# EAGLE design TSAL Proto18_rev3.1 (EAGLE 7.2.0)
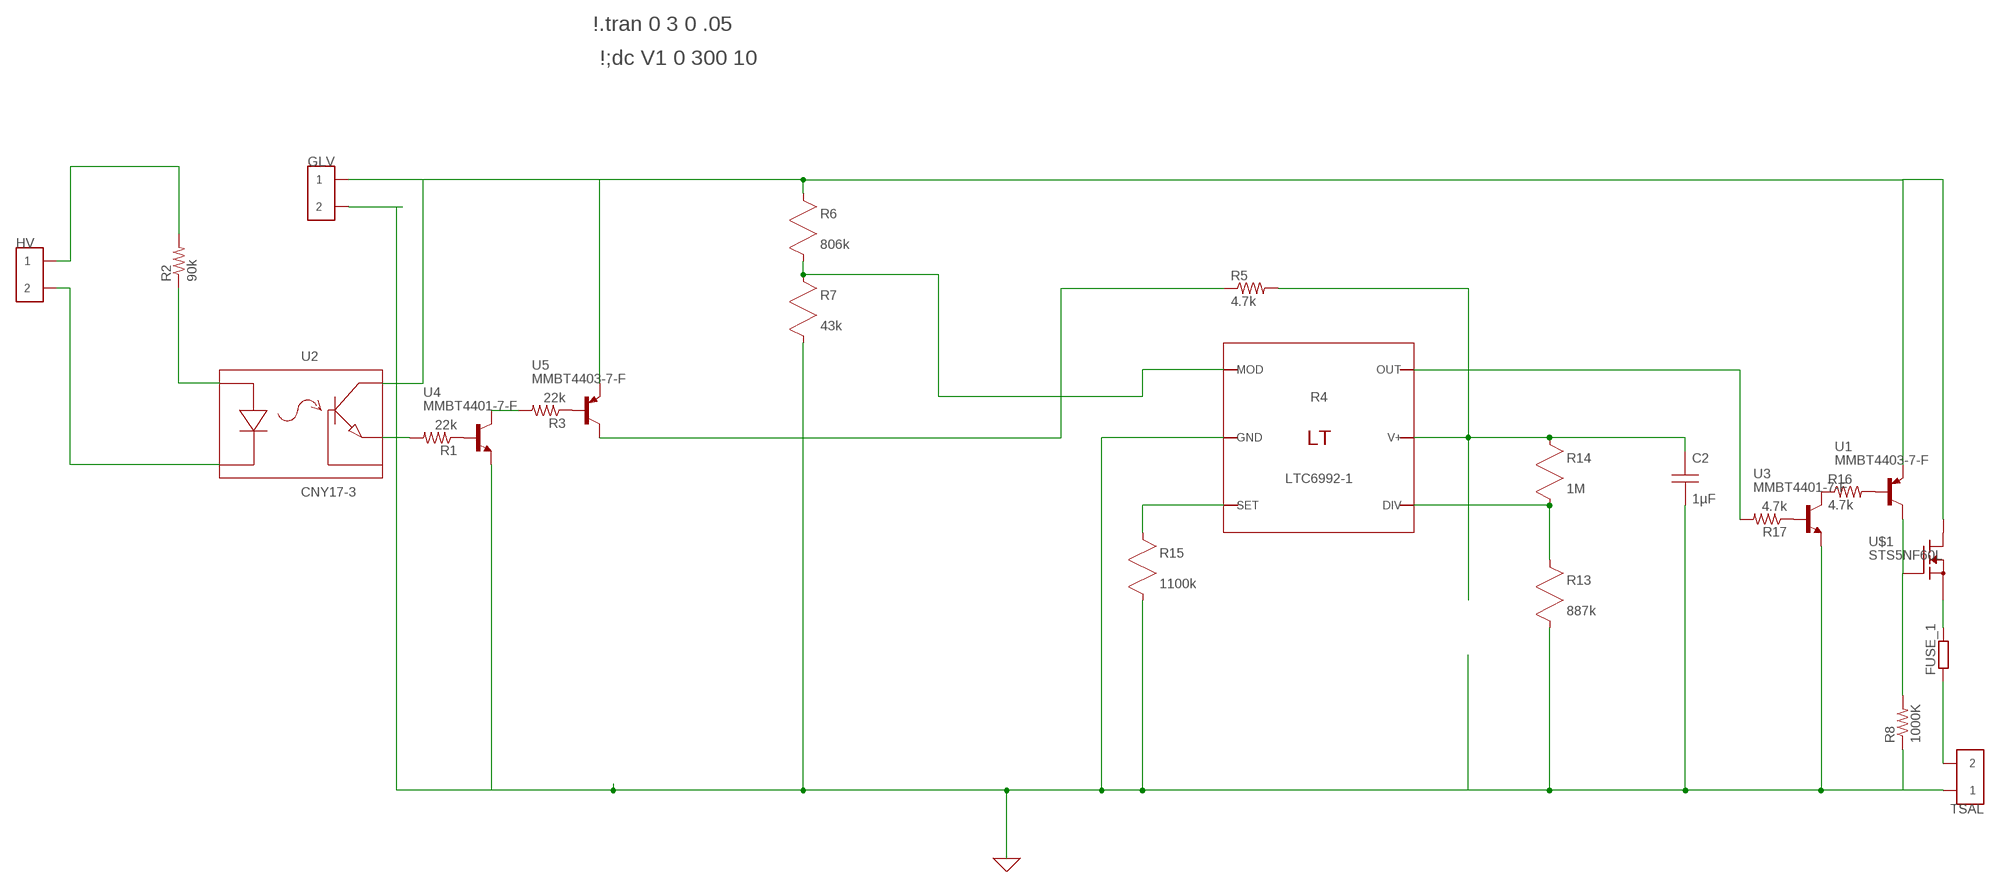
[diagram p0: schematic, sheet 1]

## Parts
C2  1µF  CAP  [C0805]
FUSE_1  R-EU_R0402  [R0402]
GLV  CONN_2  [CONNECTOR_2]
HV  CONN_2  [CONNECTOR_2]
R1  22k  R-US_R0402  [R0402]
R2  90k  R-US_0817/22  [P0817/22]
R3  22k  R-US_R0402  [R0402]
R4  LTC6992-1  [LTC6992-1]
R5  4.7k  RESISTOR0805-RES  [0805]
R6  806k  RES  [R0805]
R7  43k  RES  [R0805]
R8  1000K  RESISTOR0805-RES  [0805]
R13  887k  RES  [R0805]
R14  1M  RES  [R0805]
R15  1100k  RES  [R0805]
R16  4.7k  R-US_R0402  [R0402]
R17  4.7k  R-US_R0402  [R0402]
TSAL  CONN_2  [CONNECTOR_2]
U1  MMBT4403-7-F  [SOT-23-3]
U2  CNY17-3  [CNY17-3]
U3  MMBT4401-7-F  [SOT-23-3]
U4  MMBT4401-7-F  [SOT-23-3]
U5  MMBT4403-7-F  [SOT-23-3]
U$1  STS5NF60L  [SO08]

## Nets
12V: GLV.1 GLV.2 R6.1(A) U1.P$3(E) U2.P$5(C) U5.P$3(E) U$1.5(D) U$1.6(D) U$1.7(D) U$1.8(D)
GND: C2.2(B) GLV.3 GLV.4 R4.P$2(GND) R7.2(B) R8.1 R13.2(B) R15.2(B) TSAL.1 TSAL.2 U3.P$3(E) U4.P$3(E) ; supply symbol labelled 0
HV+: HV.1 HV.2 R2.2
HV-: HV.3 HV.4 U2.P$2(K)
N$1: R1.1 U4.P$2(B)
N$2: R3.1 U5.P$2(B)
N$3: R3.2 U4.P$1(C)
N$4: R1.2 U2.P$4(E)
N$5: R5.1 U5.P$1(C)
N$6: R8.2 U1.P$1(C) U$1.4(G)
N$7: R4.P$1(MOD) R6.2(B) R7.1(A)
N$8: R4.P$6(OUT) R17.2
N$9: R2.1 U2.P$1(A)
N$10: FUSE_1.2 U$1.1(S) U$1.2(S) U$1.3(S)
N$11: R16.2 U1.P$2(B)
N$13: R16.1 U3.P$1(C)
N$15: C2.1(A) R4.P$5(V+) R5.2 R14.1(A)
N$18: R4.P$3(SET) R15.1(A)
N$19: R4.P$4(DIV) R13.1(A) R14.2(B)
N$21: R17.1 U3.P$2(B)
TSAL+: FUSE_1.1 TSAL.3 TSAL.4
Unconnected: U2.P$6(B)

## Notes on the sheet
- \!.tran 0 3 0 .05
- \!;dc V1 0 300 10

## Library data of the parts
C2 = sym:CAP: Capacitor
FUSE_1 = resistor:R-EU_: RESISTOR, European symbol
GLV HV TSAL = formula electric:CONN_2
R1-R3 R16 R17 = resistor:R-US_: RESISTOR, American symbol
R4 = FE_Kenny:LTC6992-1
R5 R8 = SparkFun-Resistors:RESISTOR: Resistor Basic schematic elements and footprints for 0603, 1206, and PTH resistors.
R6 R7 R13-R15 = sym:RES: A resistor
U1 U5 = formula electric:MMBT4403-7-F
U2 = FE_Kenny:CNY17-3
U3 U4 = formula electric:MMBT4401-7-F
U$1 = st-microelectronics:STS5NF60L

## Board
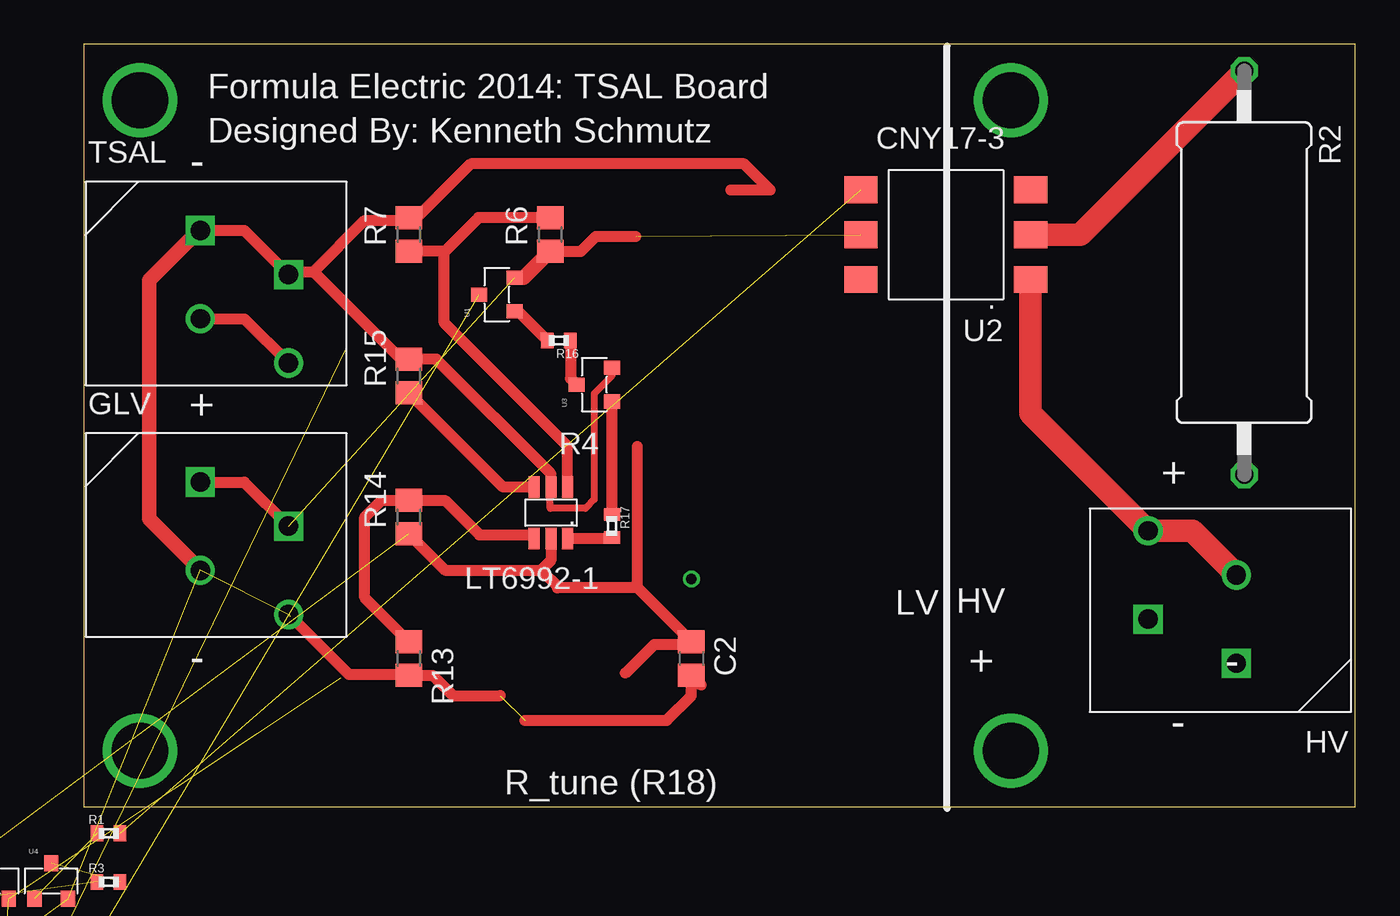
[diagram p1: board, top side]
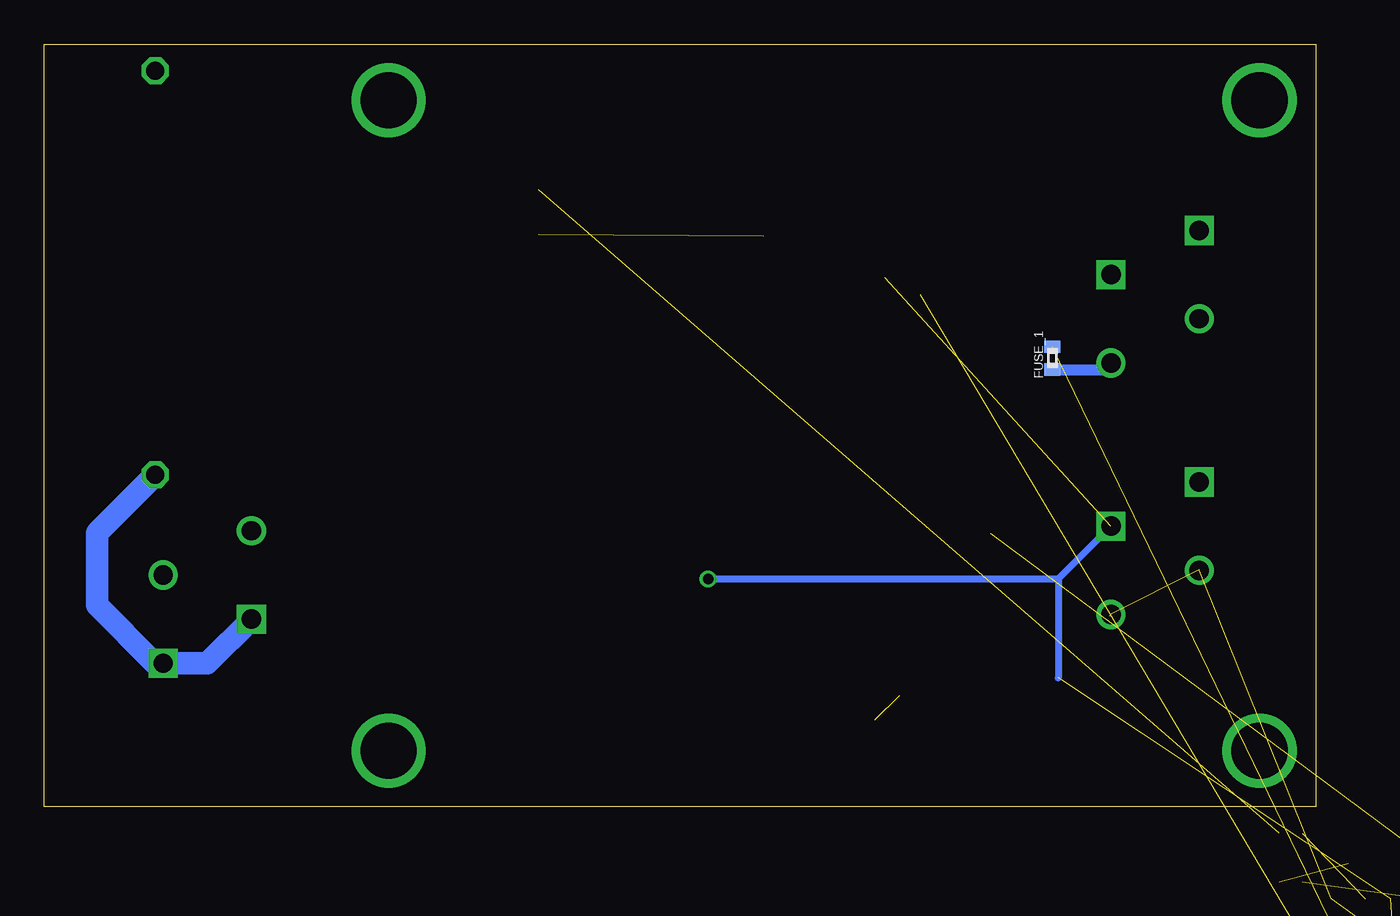
[diagram p2: board, bottom side, seen from below]

Size 72 x 43.17 mm. Coordinates in mm from the lower left corner, seen from the top.
Outline: 0,0 72,0 72,43.17 0,43.17 0,0
Copper layers (1*16): Top 0.0356mm / dielectric 1.5011mm / Bottom 0.0356mm
Design rules "OshPark DRC": minimum track width 6mil, minimum drill 13mil, track to track 6mil, track to pad 6mil, pad to pad 6mil, via to via 6mil, smd to smd 6mil, copper to edge 15mil, drill to drill 6mil, minimum pad ring 7mil, minimum via ring 7mil, stop-mask expansion 3mil, vias tented up to drill 0mil, thermal gap 10mil

### Footprints (pad centres in the part's own frame; a part is rotated, then mirrored left to right if it is on the bottom)
C0805 = smd 1.3 x 1.5: 1 -0.95,0; 2 0.95,0
R0402 = smd 0.7 x 0.9: 1 -0.65,0; 2 0.65,0
CONNECTOR_2 = drill 1.1 square: 1 0,0; 2 2.5,5 | drill 1.1: 3 5,0; 4 7.5,5
P0817/22 = drill 1.016 octagon: 1 -11.43,0; 2 11.43,0
LTC6992-1 = smd 0.62 x 1.22: P$1 0.5,-0.7; P$2 1.45,-0.7; P$3 2.4,-0.7; P$4 2.4,2.2; P$5 1.45,2.2; P$6 0.5,2.2
0805 = smd 0.8 x 1.2: 1 -0.9,0; 2 0.9,0
R0805 = smd 1.3 x 1.5: 1 -0.95,0; 2 0.95,0
SOT-23-3 = smd 0.8 x 0.9: P$1 0,1; P$2 -0.95,-1; P$3 0.95,-1
CNY17-3 = smd 1.88 x 1.52: P$1 -1.55,3.65; P$2 -1.55,6.19; P$3 -1.55,1.11; P$4 8.05,1.11; P$5 8.05,3.65; P$6 8.05,6.19
SO08 = smd 0.6 x 2.2: 1 -1.905,-2.6; 2 -0.635,-2.6; 3 0.635,-2.6; 4 1.905,-2.6; 5 1.905,2.6; 6 0.635,2.6; 7 -0.635,2.6; 8 -1.905,2.6

### Placement (x,y rotation side)
C2  34.4,8.4 270 top
FUSE_1  14.9,25.4 90 bottom
GLV  6.59,18.39 270 top
HV  65.26,8.13 90 top
R1  1.4,-1.5 0 top
R2  65.7,30.24 270 top
R3  1.4,-4.25 0 top  (outside the outline)
R4  27.9,17.4 180 top
R5  -8.5,-3.85 0 top  (outside the outline)
R6  26.4,32.4 90 top
R7  18.4,32.4 90 top
R8  -11.55,-13.55 0 top  (outside the outline)
R13  18.4,8.4 270 top
R14  18.4,16.4 90 top
R15  18.4,24.4 90 top
R16  26.9,26.4 180 top
R17  29.9,15.9 270 top
TSAL  6.59,32.63 270 top
U1  23.38,29 90 top
U2  52.06,36.04 180 top
U3  28.9,23.9 90 top
U4  -1.85,-4.2 0 top  (outside the outline)
U5  -5.2,-4.2 0 top  (outside the outline)
U$1  -5.15,-11.5 0 top  (outside the outline)

### Tracks (layer width: path | path; a pad name or v marks a point on that pad's centre or on a via)
12V  (via drill 0.6)  (7 unrouted)
  Top 0.61: GLV.1 9.09,18.39 GLV.2 | R6.1 28.15,31.45 29,32.3 31.27,32.3
  Top 0.813: U1.P$3 24.9,29.95 R6.1
  Bottom 0.406: v34.4,12.9 14.58,12.9 | 14.58,12.9 GLV.2 | 14.6,12.88 14.58,12.9 | 14.58,12.9 14.58,7.3
GND  (6 unrouted)
  Top 0.406: 18.85,33.35 R7.2 18.25,33.2 | 26.45,18.85 R4.P$2 26.4,18.05 26.4,16.9 28.4,16.9 28.9,17.4 28.9,23.4 29.9,24.4 U3.P$3 | R15.2 17.95,25.35 | 11.68,10.8 11.7,10.8 | 18.35,7.5 R13.2
  Top 0.61: 18.85,33.35 21.9,36.4 37.38,36.4 38.85,34.93 36.62,34.93 | 26.45,18.85 19.95,25.35 R15.2 | TSAL.1 9.09,32.63 TSAL.2 11.76,30.3 13,30.3 | 24.98,4.9 33,4.9 34.4,6.3 C2.2 34.95,6.89 | 13,30.3 15.9,33.2 18.25,33.2 | 17.95,25.35 13,30.3 | 11.7,10.8 15,7.5 18.35,7.5 | R13.2 19.75,7.45 20.9,6.3 23.57,6.3
  Top 0.813: TSAL.1 6.53,32.63 3.7,29.8 3.7,16.3 6.59,13.41
HV+
  Bottom 1.27: R2.2 69,15.51 69,11.4 65.73,8.13 HV.1 62.76,8.13 HV.2
HV-
  Top 1.27: U2.P$2 53.61,22.28 HV.4 62.76,15.63 HV.3
N$1  (1 unrouted)
N$2  (1 unrouted)
N$3  (1 unrouted)
N$4  (1 unrouted)
N$5  (1 unrouted)
N$6  (2 unrouted)
N$7
  Top 0.406: 20.4,31.4 20.45,31.45
  Top 0.61: R6.2 22.35,33.35 20.45,31.45 R7.1 | R4.P$1 27.4,20.4 20.4,27.4 20.4,31.4
N$8
  Top 0.61: R4.P$6 29.85,15.2 R17.2
N$9
  Top 1.27: U2.P$1 56.42,32.39 R2.1
N$10  (3 unrouted)
N$11
  Top 0.61: U1.P$2 24.6,28.05 R16.2
N$13
  Top 0.61: R16.1 27.55,24.25 U3.P$1
N$14  (via drill 3.17)
  other vias: 3.17,40
N$15  (1 unrouted)
  Top 0.406: 26.82,12.4 26.82,12.48
  Top 0.61: R14.1 20.45,13.4 25.9,13.4 | 31.35,12.4 C2.1 34.25,9.2 32.3,9.2 30.66,7.57 | 31.35,12.4 26.82,12.4 | 31.35,12.4 31.35,20.4 | 25.9,13.4 26.82,12.48 | R4.P$5 26.45,13.95 25.9,13.4
N$16  (via drill 3.17)
  other vias: 52.5,40
N$17  (via drill 3.17)
  other vias: 52.5,3.17
N$18
  Top 0.61: R4.P$3 23.75,18.1 R15.1
N$19
  Top 0.61: R13.1 15.9,11.85 15.9,16.4 16.85,17.35 R14.2 20.45,17.35 22.4,15.4 25.3,15.4 R4.P$4
N$20  (via drill 3.17)
  other vias: 3.17,3.17
N$21
  Top 0.61: R17.1 U3.P$2
TSAL+
  Top 0.61: TSAL.3 9.09,27.63 TSAL.4
  Bottom 0.61: 11.61,25.15 TSAL.4 11.97,24.75 FUSE_1.1

### Text on the board
tPlace: - | + | + | - | + | - | -
tNames: Formula Electric 2014: TSAL Board | Designed By: Kenneth Schmutz | LV | HV | R_tune (R18)